# EAGLE design EFIS (EAGLE 6.5.0)
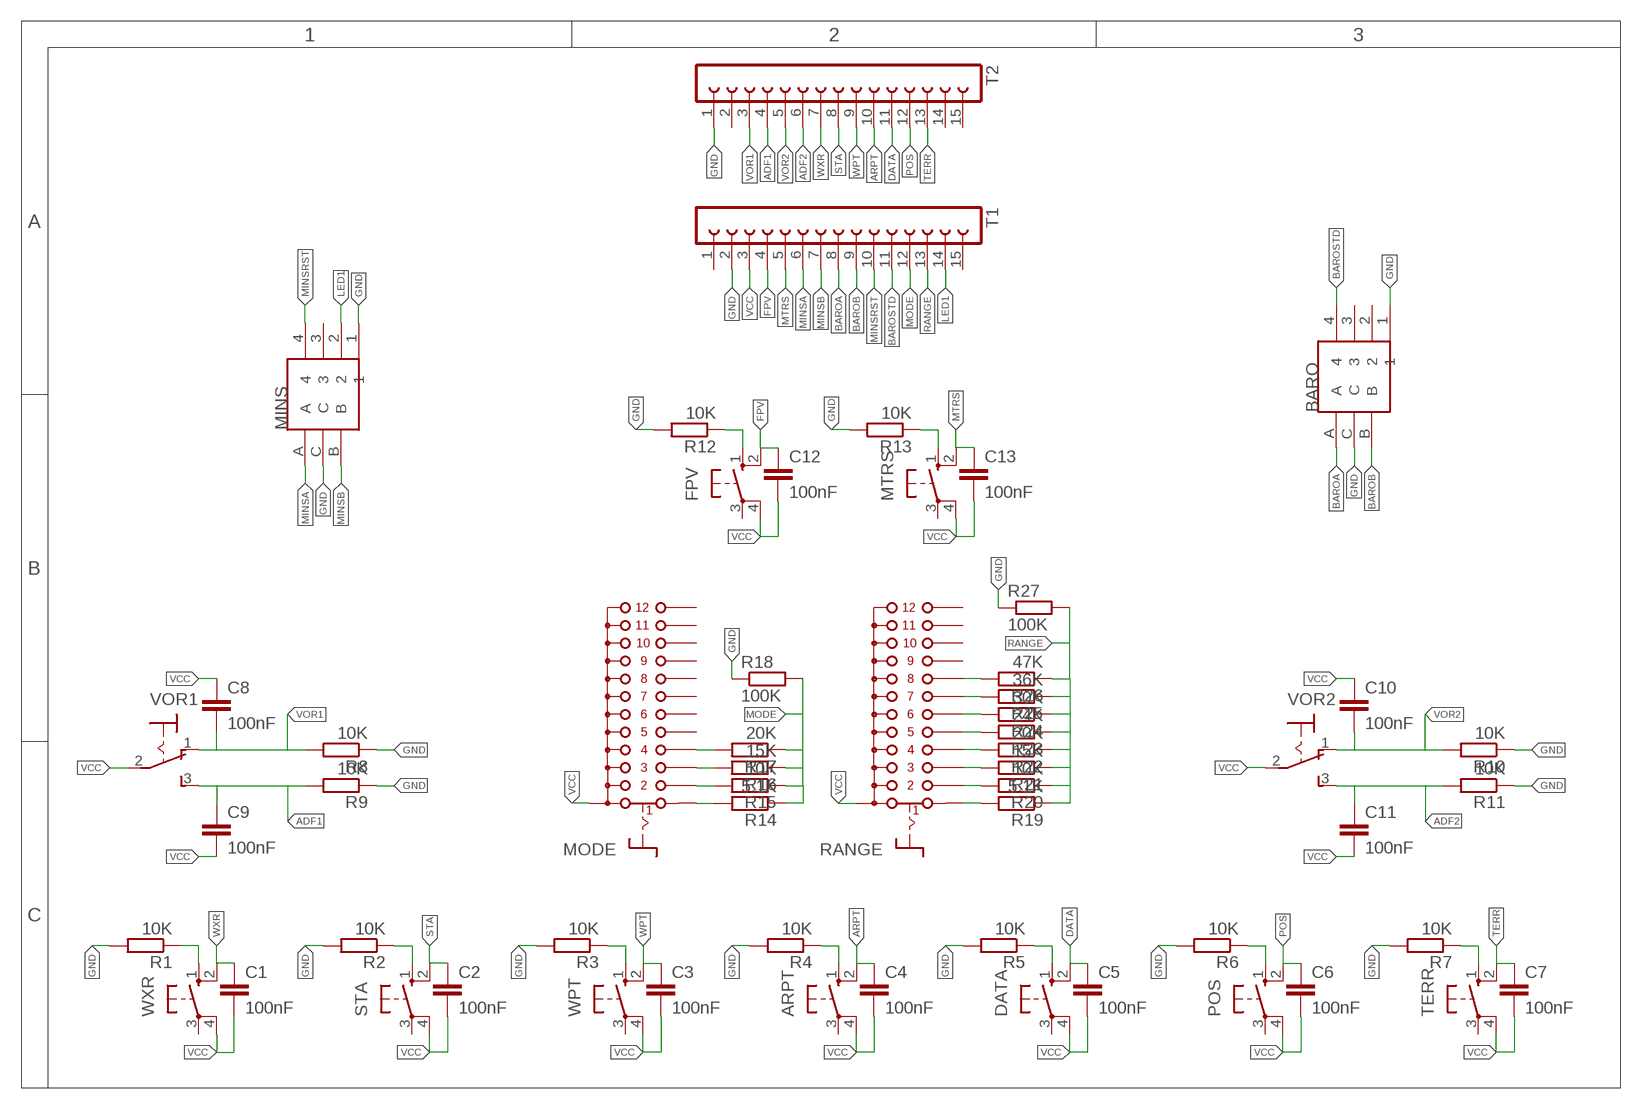
[diagram p0: schematic, sheet 1]

## Parts
ARPT  10-XX  [B3F-10XX]
BARO  MERP12246GR  [MERP1224126]
C1  100nF  C-EUC1206  [C1206]
C2  100nF  C-EUC1206  [C1206]
C3  100nF  C-EUC1206  [C1206]
C4  100nF  C-EUC1206  [C1206]
C5  100nF  C-EUC1206  [C1206]
C6  100nF  C-EUC1206  [C1206]
C7  100nF  C-EUC1206  [C1206]
C8  100nF  C-EUC1206  [C1206]
C9  100nF  C-EUC1206  [C1206]
C10  100nF  C-EUC1206  [C1206]
C11  100nF  C-EUC1206  [C1206]
C12  100nF  C-EUC1206  [C1206]
C13  100nF  C-EUC1206  [C1206]
DATA  10-XX  [B3F-10XX]
FPV  10-XX  [B3F-10XX]
MINS  MERP12246GR  [MERP1224126]
MODE  CK101X12  [CK101X12]
MTRS  10-XX  [B3F-10XX]
POS  10-XX  [B3F-10XX]
R1  10K  R-EU_R1206  [R1206]
R2  10K  R-EU_R1206  [R1206]
R3  10K  R-EU_R1206  [R1206]
R4  10K  R-EU_R1206  [R1206]
R5  10K  R-EU_R1206  [R1206]
R6  10K  R-EU_R1206  [R1206]
R7  10K  R-EU_R1206  [R1206]
R8  10K  R-EU_R1206  [R1206]
R9  10K  R-EU_R1206  [R1206]
R10  10K  R-EU_R1206  [R1206]
R11  10K  R-EU_R1206  [R1206]
R12  10K  R-EU_R1206  [R1206]
R13  10K  R-EU_R1206  [R1206]
R14  5.1K  R-EU_R1206  [R1206]
R15  10K  R-EU_R1206  [R1206]
R16  15K  R-EU_R1206  [R1206]
R17  20K  R-EU_R1206  [R1206]
R18  100K  R-EU_R1206  [R1206]
R19  5.1K  R-EU_R1206  [R1206]
R20  10K  R-EU_R1206  [R1206]
R21  15K  R-EU_R1206  [R1206]
R22  20K  R-EU_R1206  [R1206]
R23  24K  R-EU_R1206  [R1206]
R24  30K  R-EU_R1206  [R1206]
R25  36K  R-EU_R1206  [R1206]
R26  47K  R-EU_R1206  [R1206]
R27  100K  R-EU_R1206  [R1206]
RANGE  CK101X12  [CK101X12]
STA  10-XX  [B3F-10XX]
T1  FE15-1  [FE15]
T2  FE15-1  [FE15]
TERR  10-XX  [B3F-10XX]
VOR1  320-916  [320-916]
VOR2  320-916  [320-916]
WPT  10-XX  [B3F-10XX]
WXR  10-XX  [B3F-10XX]

## Nets
ADF1: C9.1 R9.2 T2.4 VOR1.3(S)
ADF2: C11.1 R11.2 T2.6 VOR2.3(S)
ARPT: ARPT.2(S1) C4.1 T2.10
BAROA: BARO.A T1.8
BAROB: BARO.B T1.9
BAROSTD: BARO.4 T1.11
DATA: C5.1 DATA.2(S1) T2.11
FPV: C12.1 FPV.2(S1) T1.4
GND: BARO.1 BARO.C MINS.1 MINS.C R1.2 R2.2 R3.2 R4.2 R5.2 R6.2 R7.2 R8.1 R9.1 R10.1 R11.1 R12.2 R13.2 R18.1 R27.1 T1.2 T2.1
LED1: MINS.2 T1.14
MINSA: MINS.A T1.6
MINSB: MINS.B T1.7
MINSRST: MINS.4 T1.10
MODE: R14.1 R15.1 R16.1 R17.1 R18.2 T1.12
MTRS: C13.1 MTRS.2(S1) T1.5
N$1: R1.1 WXR.1(S)
N$4: R2.1 STA.1(S)
N$5: R3.1 WPT.1(S)
N$8: ARPT.1(S) R4.1
N$9: DATA.1(S) R5.1
N$10: POS.1(S) R6.1
N$11: R7.1 TERR.1(S)
N$12: FPV.1(S) R12.1
N$13: MTRS.1(S) R13.1
N$16: MODE.1 R14.2
N$17: MODE.2 R15.2
N$18: MODE.3 R16.2
N$19: MODE.4 R17.2
N$21: R19.2 RANGE.1
N$22: R20.2 RANGE.2
N$23: R21.2 RANGE.3
N$24: R22.2 RANGE.4
N$25: R23.2 RANGE.5
N$26: R24.2 RANGE.6
N$27: R25.2 RANGE.7
N$28: R26.2 RANGE.8
POS: C6.1 POS.2(S1) T2.12
RANGE: R19.1 R20.1 R21.1 R22.1 R23.1 R24.1 R25.1 R26.1 R27.2 T1.13
STA: C2.1 STA.2(S1) T2.8
TERR: C7.1 T2.13 TERR.2(S1)
VCC: ARPT.4(P1) C1.2 C2.2 C3.2 C4.2 C5.2 C6.2 C7.2 C8.1 C9.2 C10.1 C11.2 C12.2 C13.2 DATA.4(P1) FPV.4(P1) MODE.A MTRS.4(P1) POS.4(P1) RANGE.A STA.4(P1) T1.3 TERR.4(P1) VOR1.2(P) VOR2.2(P) WPT.4(P1) WXR.4(P1)
VOR1: C8.2 R8.2 T2.3 VOR1.1(O)
VOR2: C10.2 R10.2 T2.5 VOR2.1(O)
WPT: C3.1 T2.9 WPT.2(S1)
WXR: C1.1 T2.7 WXR.2(S1)
Unconnected: ARPT.3(P) BARO.2 BARO.3 DATA.3(P) FPV.3(P) MINS.3 MODE.5 MODE.6 MODE.7 MODE.8 MODE.9 MODE.10 MODE.11 MODE.12 MTRS.3(P) POS.3(P) RANGE.9 RANGE.10 RANGE.11 RANGE.12 STA.3(P) T1.1 T1.15 T2.2 T2.14 T2.15 TERR.3(P) WPT.3(P) WXR.3(P)

## Library data of the parts
ARPT DATA FPV MTRS POS STA TERR WPT WXR = switch-omron:10-XX: OMRON SWITCH; MPN: B3F-1000; OC_FARNELL: 176432; OC_NEWARK: 36M3542
BARO MINS = encoder:MERP12246GR
C1-C13 = rcl:C-EU: CAPACITOR, European symbol
MODE RANGE = switch:CK101X12: ROTARY SWITCH C&K
R1-R27 = resistor:R-EU_: RESISTOR, European symbol
T1 T2 = con-lsta:FE15-1: FEMALE HEADER; OC_FARNELL: unknown; OC_NEWARK: unknown
VOR1 VOR2 = switch-custom:320-916: TOGGLE SWITCH distributor RS Components

## Net classes
0 default: width 0.203 mm, clearance 0.203 mm

## Board
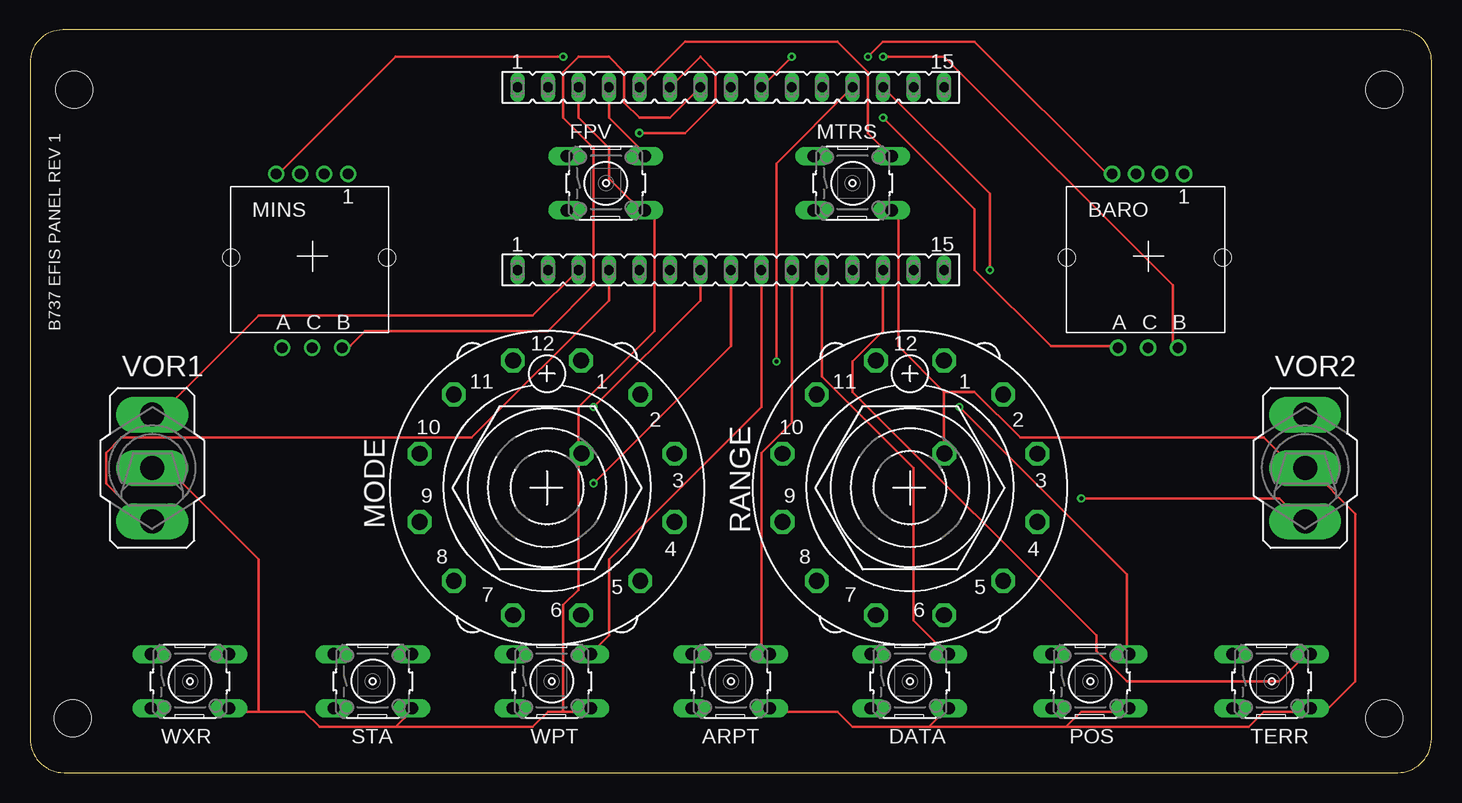
[diagram p1: board, top side]
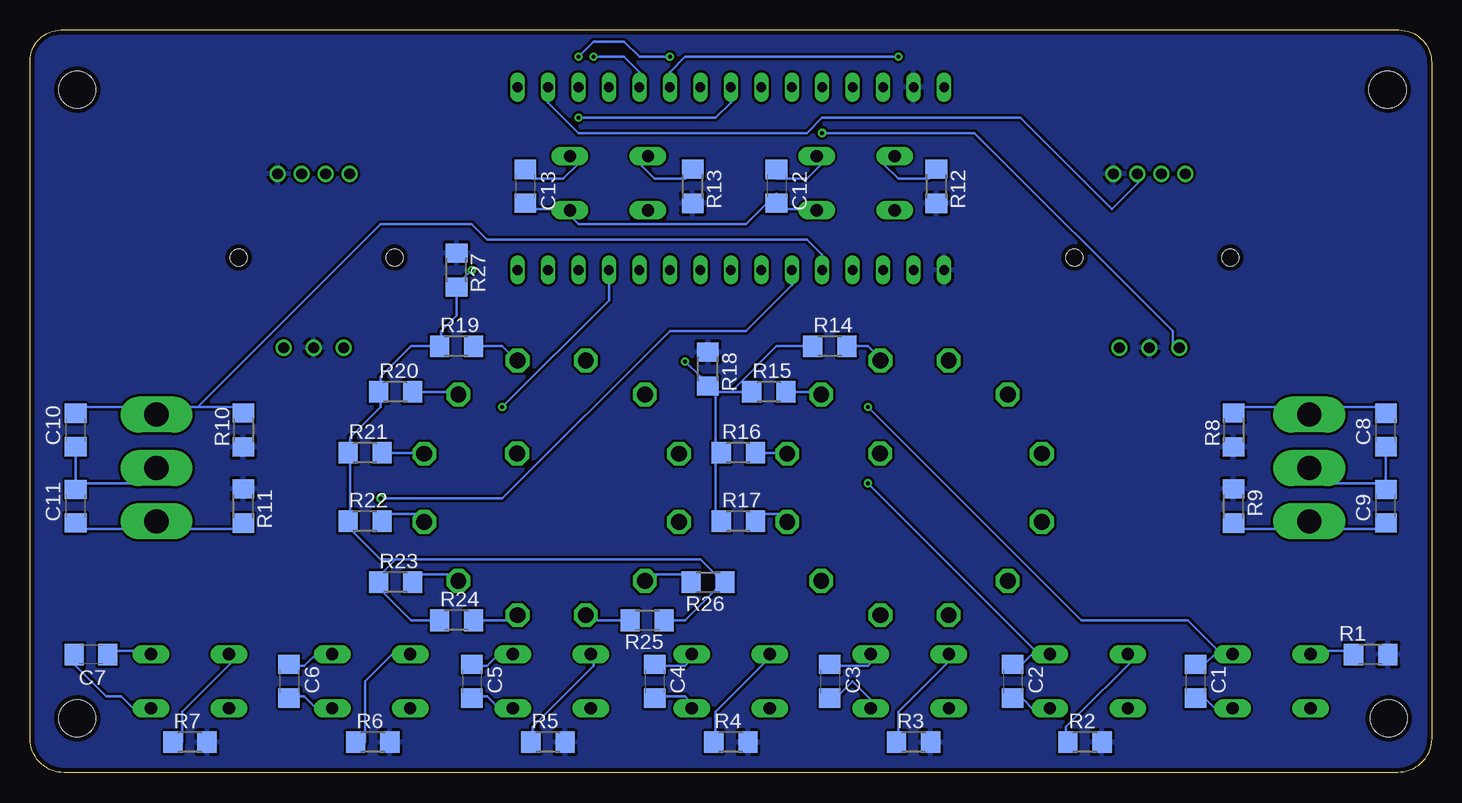
[diagram p2: board, bottom side, seen from below]

Size 116.84 x 61.93 mm. Coordinates in mm from the lower left corner, seen from the top.
Outline: 0,59.21 0,2.84 arc90 2.84,0 114,0 arc90 116.84,2.84 116.84,59.35 arc90 114.27,61.92 2.72,61.92 arc90 0,59.21
Copper layers (1*16): Top 0.0356mm / dielectric 1.5011mm / Bottom 0.0356mm
Design rules "LaenPCBOrder": minimum track width 6mil, minimum drill 13mil, track to track 6mil, track to pad 6mil, pad to pad 6mil, via to via 6mil, smd to smd 6mil, copper to edge 15mil, drill to drill 6mil, minimum pad ring 7mil, minimum via ring 7mil, stop-mask expansion 3mil, vias tented up to drill 0mil, thermal gap 10mil
Holes 3.07 mm at 3.56,4.52 3.67,56.96 112.89,56.96 112.89,4.52

### Footprints (pad centres in the part's own frame; a part is rotated, then mirrored left to right if it is on the bottom)
B3F-10XX = drill 1.016 long: 1 -3.251,2.261; 2 3.251,2.261; 3 -3.251,-2.261; 4 3.251,-2.261
MERP1224126 = drill 0.9: 1 5.5,14.5; 2 3.5,14.5; 3 1.5,14.5; 4 -0.5,14.5; A 0,0; B 5,0; C 2.5,0 | hole 1.4: -4.25,7.5; 8.75,7.5
C1206 = smd 1.6 x 1.8: 1 -1.4,0; 2 1.4,0
CK101X12 = drill 1.321 octagon: 1 -2.845,-10.617; 2 -7.772,-7.772; 3 -10.617,-2.845; 4 -10.617,2.845; 5 -7.772,7.772; 6 -2.845,10.617; 7 2.845,10.617; 8 7.772,7.772; 9 10.617,2.845; 10 10.617,-2.845; 11 7.772,-7.772; 12 2.845,-10.617; A -2.87,-2.87
R1206 = smd 1.6 x 1.803: 1 -1.422,0; 2 1.422,0
FE15 = drill 0.813 long: 1 -17.78,0; 2 -15.24,0; 3 -12.7,0; 4 -10.16,0; 5 -7.62,0; 6 -5.08,0; 7 -2.54,0; 8 0,0; 9 2.54,0; 10 5.08,0; 11 7.62,0; 12 10.16,0; 13 12.7,0; 14 15.24,0; 15 17.78,0
320-916 = drill 2.007 long: 1 0,4.45; 2 0,0; 3 0,-4.45

### Placement (x,y rotation side)
ARPT  58.42,7.62 0 top
BARO  90.7,35.43 0 top
C1  19.68,7.62 270 bottom
C2  34.92,7.62 270 bottom
C3  50.16,7.62 270 bottom
C4  64.77,7.62 270 bottom
C5  80.01,7.62 270 bottom
C6  95.25,7.62 270 bottom
C7  111.76,9.84 180 bottom
C8  3.81,28.57 90 bottom
C9  3.81,22.23 90 bottom
C10  113.03,28.57 90 bottom
C11  113.03,22.23 90 bottom
C12  54.61,48.9 270 bottom
C13  75.56,48.9 270 bottom
DATA  73.34,7.62 0 top
FPV  48.01,49.15 0 top
MINS  21.02,35.43 0 top
MODE  43.1,23.75 180 top
MTRS  68.58,49.15 0 top
POS  88.39,7.62 0 top
R1  5.08,9.84 0 bottom
R2  28.89,2.54 0 bottom
R3  43.18,2.54 0 bottom
R4  58.42,2.54 0 bottom
R5  73.66,2.54 0 bottom
R6  88.27,2.54 0 bottom
R7  103.5,2.54 0 bottom
R8  16.51,28.57 90 bottom
R9  16.51,22.23 270 bottom
R10  99.06,28.57 90 bottom
R11  99.06,22.23 270 bottom
R12  41.27,48.9 270 bottom
R13  61.59,48.9 270 bottom
R14  50.16,35.56 0 bottom
R15  55.24,31.75 0 bottom
R16  57.78,26.67 0 bottom
R17  57.78,20.95 0 bottom
R18  60.33,33.66 270 bottom
R19  81.28,35.56 0 bottom
R20  86.36,31.75 0 bottom
R21  88.9,26.67 0 bottom
R22  88.9,20.95 0 bottom
R23  86.36,15.88 0 bottom
R24  81.28,12.7 0 bottom
R25  65.41,12.7 180 bottom
R26  60.33,15.88 180 bottom
R27  81.28,41.91 270 bottom
RANGE  73.36,23.75 180 top
STA  28.57,7.62 0 top
T1  58.42,57.15 0 top
T2  58.42,41.91 0 top
TERR  103.5,7.62 0 top
VOR1  10.19,25.4 0 top
VOR2  106.3,25.4 0 top
WPT  43.5,7.62 0 top
WXR  13.34,7.62 0 top

### Tracks (layer width: path | path; a pad name or v marks a point on that pad's centre or on a via)
ADF1
  Top 0.203: T2.4 48.26,39.37 36.83,27.94 7.62,27.94 6.35,26.67 6.35,24.13 10.16,20.32 VOR1.3
  Bottom 0.203: C9.1 3.81,20.32 10.16,20.32 VOR1.3 11.43,20.32 16.51,20.32 R9.2
ADF2  (via drill 0.33)
  Top 0.203: v87.63,22.86 104.14,22.86 105.41,21.59 VOR2.3
  Bottom 0.203: C11.1 113.03,20.32 106.68,20.32 VOR2.3 105.41,20.32 99.06,20.32 R11.2 | T2.6 53.34,40.64 57.15,36.83 63.5,36.83 77.47,22.86 v87.63,22.86
ARPT
  Top 0.203: T2.10 63.5,29.21 60.96,26.67 60.96,10.16 ARPT.2
  Bottom 0.203: C4.1 64.77,8.89 62.23,8.89 60.96,10.16 ARPT.2
BAROA  (via drill 0.33)
  Top 0.203: v71.12,54.61 78.74,46.99 78.74,41.91 85.09,35.56 90.17,35.56 BARO.A
  Bottom 0.203: T1.8 58.42,55.88 59.69,54.61 v71.12,54.61
BAROB  (via drill 0.33)
  Top 0.203: v63.5,59.69 T1.9 | v71.12,59.69 76.2,59.69 95.25,40.64 95.25,35.56 BARO.B
  Bottom 0.203: v63.5,59.69 66.04,59.69 67.31,60.96 69.85,60.96 v71.12,59.69
BAROSTD  (via drill 0.33)
  Top 0.203: v69.85,59.69 71.12,60.96 78.74,60.96 90.17,49.53 BARO.4
  Bottom 0.203: T1.11 66.04,58.42 67.31,59.69 v69.85,59.69
DATA
  Top 0.203: T2.11 66.04,33.02 73.66,25.4 73.66,12.7 76.2,10.16 DATA.2
  Bottom 0.203: C5.1 80.01,8.89 78.74,8.89 77.47,10.16 DATA.2
FPV
  Top 0.203: T1.4 48.26,54.61 50.8,52.07 FPV.2
  Bottom 0.203: C12.1 54.61,49.53 52.07,49.53 50.8,50.8 FPV.2
GND
  pour Bottom: -1.27,62.23 118.11,62.23 118.11,-1.27 -1.27,-1.27
LED1
  Bottom 0.203: T1.14 73.66,55.88 71.12,53.34 52.07,53.34 50.8,54.61 34.29,54.61 26.67,46.99 24.13,49.53 MINS.2
MINSA  (via drill 0.33)
  Top 0.203: T1.6 55.88,59.69 57.15,58.42 57.15,55.88 54.61,53.34 v50.8,53.34
  Bottom 0.203: v50.8,53.34 38.1,53.34 21.59,36.83 21.59,35.56 MINS.A
MINSB
  Top 0.203: T1.7 53.34,54.61 50.8,54.61 49.53,55.88 49.53,58.42 48.26,59.69 45.72,59.69 44.45,58.42 44.45,54.61 46.99,52.07 46.99,40.64 43.18,36.83 27.94,36.83 26.67,35.56 MINS.B
MINSRST  (via drill 0.33)
  Top 0.203: v44.45,59.69 30.48,59.69 20.32,49.53 MINS.4
  Bottom 0.203: T1.10 63.5,58.42 62.23,59.69 v44.45,59.69
MODE  (via drill 0.33)
  Top 0.203: T1.12 62.23,50.8 v62.23,34.29
  Bottom 0.203: 59.69,26.67 59.69,21.59 R17.1 | 59.69,31.75 58.42,31.75 | 58.42,31.75 R15.1 | R14.1 54.61,35.56 58.42,31.75 | v62.23,34.29 60.96,33.02 R18.2 59.69,31.75 | 59.69,31.75 59.69,26.67 | 59.69,26.67 R16.1
MTRS
  Top 0.203: T1.5 54.61,60.96 67.31,60.96 69.85,58.42 69.85,53.34 71.12,52.07 MTRS.2
  Bottom 0.203: C13.1 74.93,49.53 72.39,49.53 71.12,50.8 MTRS.2
N$1
  Bottom 0.203: R1.1 6.35,10.16 8.89,10.16 WXR.1
N$4
  Bottom 0.203: R2.1 30.48,2.54 30.48,3.81 24.13,10.16 STA.1
N$5
  Bottom 0.203: R3.1 44.45,2.54 44.45,5.08 39.37,10.16 WPT.1
N$8
  Bottom 0.203: R4.1 59.69,2.54 59.69,5.08 54.61,10.16 ARPT.1
N$9
  Bottom 0.203: R5.1 74.93,2.54 74.93,3.81 69.85,8.89 69.85,10.16 DATA.1
N$10
  Bottom 0.203: R6.1 88.9,2.54 88.9,7.62 86.36,10.16 POS.1
N$11
  Bottom 0.203: R7.1 104.14,2.54 104.14,5.08 99.06,10.16 TERR.1
N$12
  Bottom 0.203: R12.1 41.91,49.53 44.45,49.53 45.72,50.8 FPV.1
N$13
  Bottom 0.203: R13.1 62.23,49.53 64.77,49.53 66.04,50.8 MTRS.1
N$16
  Bottom 0.203: R14.2 46.99,35.56 45.72,34.29 MODE.1
N$17
  Bottom 0.203: R15.2 50.8,31.75 MODE.2
N$18
  Bottom 0.203: R16.2 54.61,26.67 MODE.3
N$19
  Bottom 0.203: R17.2 55.88,21.59 53.34,21.59 MODE.4
N$21
  Bottom 0.203: 80.01,35.56 R19.2 77.47,35.56 76.2,34.29 RANGE.1
N$22
  Bottom 0.203: 85.09,31.75 R20.2 81.28,31.75 RANGE.2
N$23
  Bottom 0.203: 87.63,26.67 R21.2 83.82,26.67 RANGE.3
N$24
  Bottom 0.203: R22.2 87.63,21.59 83.82,21.59 RANGE.4
N$25
  Bottom 0.203: R23.2 85.09,16.51 81.28,16.51 RANGE.5
N$26
  Bottom 0.203: 80.01,12.7 R24.2 76.2,12.7 RANGE.6
N$27
  Bottom 0.203: R25.2 69.85,12.7 RANGE.7
N$28
  Bottom 0.203: R26.2 62.23,16.51 64.77,16.51 RANGE.8
POS  (via drill 0.33)
  Top 0.203: v77.47,30.48 91.44,16.51 91.44,10.16 POS.2
  Bottom 0.203: C6.1 95.25,8.89 93.98,8.89 92.71,10.16 POS.2 | T2.12 68.58,39.37 v77.47,30.48
RANGE  (via drill 0.33)
  Top 0.203: T1.13 80.01,48.26 v80.01,41.91
  Bottom 0.203: v80.01,41.91 81.28,40.64 R27.2 81.28,38.1 82.55,36.83 82.55,35.56 R19.1 85.09,35.56 87.63,33.02 87.63,31.75 | 90.17,26.67 90.17,21.59 R22.1 90.17,20.32 87.63,17.78 86.36,17.78 | 87.63,31.75 87.63,30.48 90.17,27.94 90.17,26.67 | 90.17,26.67 R21.1 | R25.1 62.23,12.7 59.69,15.24 R26.1 59.69,16.51 60.96,17.78 86.36,17.78 | 82.55,12.7 R24.1 85.09,12.7 87.63,15.24 R23.1 87.63,16.51 86.36,17.78 | 87.63,31.75 R20.1
STA  (via drill 0.33)
  Top 0.203: T2.8 58.42,35.56 v46.99,24.13
  Bottom 0.203: 33.02,10.16 34.29,8.89 C2.1 | 33.02,10.16 v46.99,24.13 | 33.02,10.16 STA.2
TERR
  Top 0.203: T2.13 71.12,36.83 68.58,34.29 68.58,31.75 88.9,11.43 88.9,10.16 91.44,7.62 104.14,7.62 106.68,10.16 TERR.2
  Bottom 0.203: C7.1 110.49,10.16 107.95,10.16 TERR.2
VCC
  Top 0.203: 76.2,31.75 76.2,26.67 RANGE.A | 76.2,31.75 72.39,35.56 72.39,46.99 MTRS.4 | 74.93,3.81 68.58,3.81 67.31,5.08 62.23,5.08 ARPT.4 | 74.93,3.81 76.2,5.08 DATA.4 | 86.36,3.81 87.63,5.08 91.44,5.08 POS.4 | 74.93,3.81 86.36,3.81 | 86.36,3.81 101.6,3.81 102.87,5.08 106.68,5.08 TERR.4 107.95,5.08 110.49,7.62 110.49,21.59 106.68,25.4 VOR2.2 105.41,25.4 102.87,27.94 82.55,27.94 78.74,31.75 76.2,31.75 | T1.3 45.72,54.61 48.26,52.07 48.26,49.53 50.8,46.99 FPV.4 52.07,46.99 52.07,36.83 45.72,30.48 45.72,26.67 | 19.05,5.08 22.86,5.08 24.13,3.81 30.48,3.81 | 19.05,5.08 17.78,5.08 WXR.4 | 30.48,3.81 31.75,5.08 STA.4 | 44.45,5.08 43.18,5.08 41.91,3.81 30.48,3.81 | 44.45,5.08 45.72,5.08 WPT.4 | 45.72,26.67 45.72,15.24 44.45,13.97 44.45,5.08 | 19.05,5.08 19.05,17.78 11.43,25.4 VOR1.2 | 45.72,26.67 MODE.A
  Bottom 0.203: 72.39,46.99 74.93,46.99 C13.2 | C10.1 113.03,24.13 | 113.03,24.13 107.95,24.13 106.68,25.4 VOR2.2 | 113.03,24.13 C11.2 | C7.2 113.03,10.16 113.03,8.89 110.49,6.35 109.22,6.35 107.95,5.08 TERR.4 | C6.2 95.25,6.35 93.98,6.35 92.71,5.08 POS.4 | C4.2 64.77,6.35 62.23,6.35 60.96,5.08 ARPT.4 | C5.2 80.01,6.35 78.74,6.35 77.47,5.08 DATA.4 | FPV.4 52.07,46.99 54.61,46.99 C12.2 54.61,48.26 57.15,45.72 71.12,45.72 72.39,46.99 | C8.1 3.81,24.13 | 3.81,24.13 8.89,24.13 10.16,25.4 VOR1.2 | 3.81,24.13 C9.2 | C3.2 49.53,6.35 48.26,7.62 45.72,5.08 WPT.4 | C1.2 19.05,6.35 17.78,5.08 WXR.4 | C2.2 34.29,6.35 33.02,5.08 STA.4 | 72.39,46.99 MTRS.4
VOR1
  Top 0.203: T2.3 41.91,38.1 19.05,38.1 11.43,30.48 VOR1.1
  Bottom 0.203: C8.2 3.81,30.48 10.16,30.48 VOR1.1 11.43,30.48 16.51,30.48 R8.2
VOR2
  Bottom 0.203: C10.2 113.03,30.48 106.68,30.48 VOR2.1 105.41,30.48 102.87,30.48 | 102.87,30.48 99.06,30.48 R10.2 | T2.5 50.8,43.18 52.07,44.45 78.74,44.45 80.01,45.72 87.63,45.72 102.87,30.48
WPT
  Top 0.203: T2.9 60.96,30.48 48.26,17.78 48.26,11.43 46.99,10.16 WPT.2
  Bottom 0.203: C3.1 49.53,8.89 46.99,8.89 45.72,10.16 WPT.2
WXR  (via drill 0.33)
  Top 0.203: T2.7 55.88,39.37 v46.99,30.48
  Bottom 0.203: 17.78,10.16 19.05,8.89 C1.1 | v46.99,30.48 29.21,12.7 20.32,12.7 17.78,10.16 | 17.78,10.16 WXR.2

### Text on the board
tNames: B737 EFIS PANEL REV 1